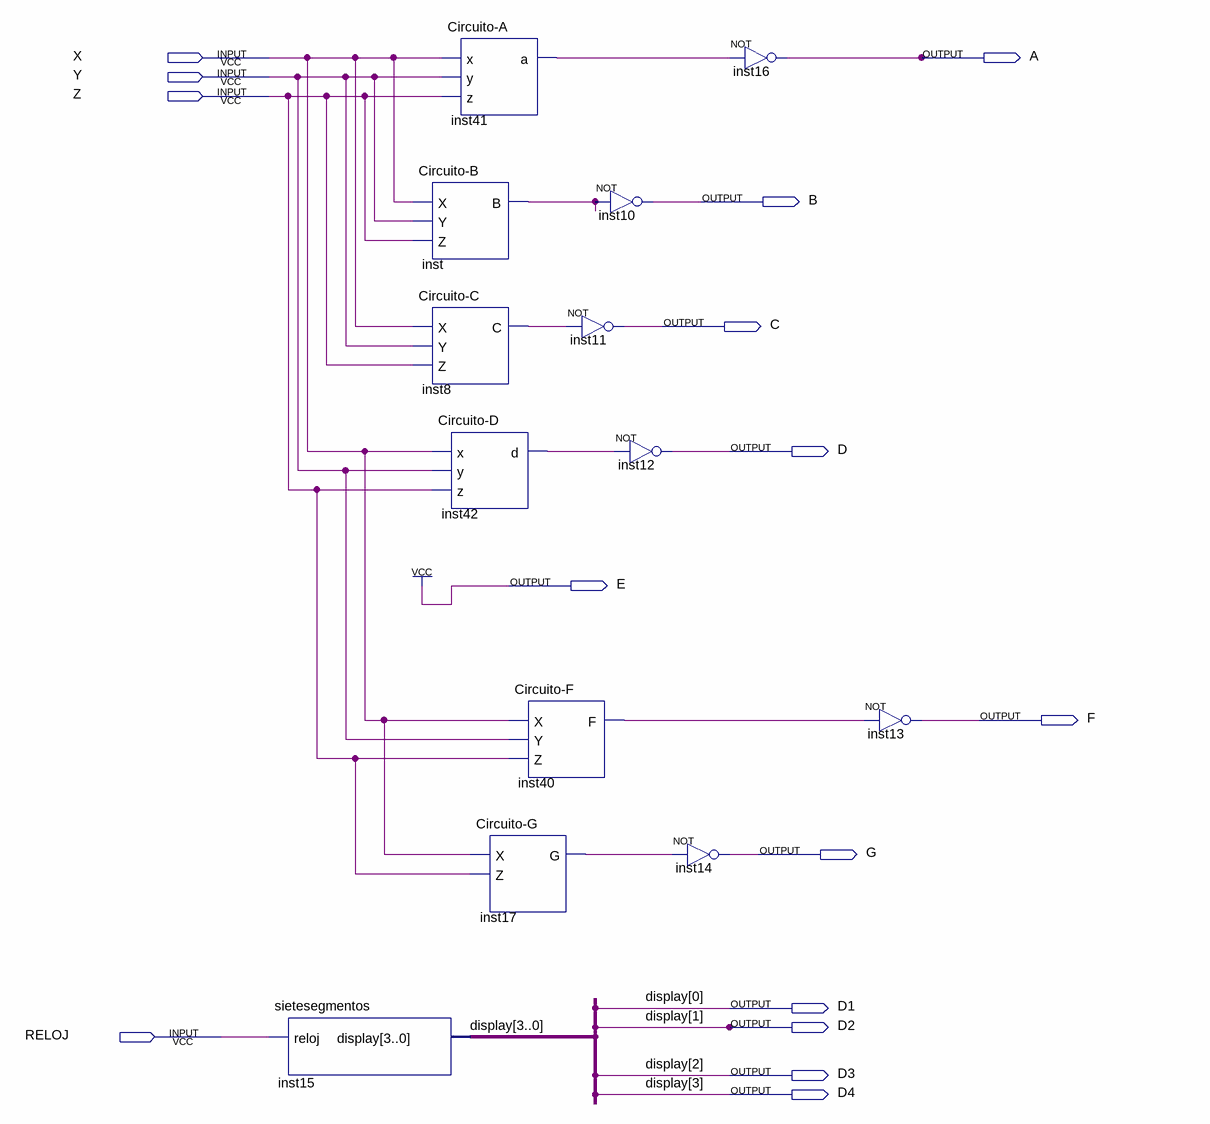
[diagram p0: schematic sheet]
// Quartus schematic Led7Segmentos.bdf as structural Verilog: 13 symbols, 15 pins
module Led7Segmentos (
  input  X,
  input  Y,
  input  Z,
  input  RELOJ,
  output A,
  output B,
  output C,
  output D,
  output E,
  output F,
  output G,
  output D1,
  output D2,
  output D3,
  output D4
);

  wire inst8_c, inst17_g, inst40_f, inst41_a, inst42_d, inst_b;

  sietesegmentos inst15 (.reloj(RELOJ), .display({D4, D3, D2, D1}));
  \Circuito-A  inst41 (.x(X), .y(Y), .z(Z), .a(inst41_a));
  \Circuito-B  inst (.X(X), .Y(Y), .Z(Z), .B(inst_b));
  \Circuito-C  inst8 (.X(X), .Y(Y), .Z(Z), .C(inst8_c));
  \Circuito-D  inst42 (.x(X), .y(Y), .z(Z), .d(inst42_d));
  \Circuito-F  inst40 (.X(X), .Y(Y), .Z(Z), .F(inst40_f));
  \Circuito-G  inst17 (.X(X), .Z(Z), .G(inst17_g));
  not inst10 (B, inst_b);
  not inst11 (C, inst8_c);
  not inst12 (D, inst42_d);
  not inst14 (G, inst17_g);
  not inst16 (A, inst41_a);
  not inst13 (F, inst40_f);

  assign E = 1'b1;

  // Other names for the same wires on the sheet: display[3:0] = {D4, D3, D2, D1}
endmodule
